# EAGLE schematic keyboard left (EAGLE 6.6.0)
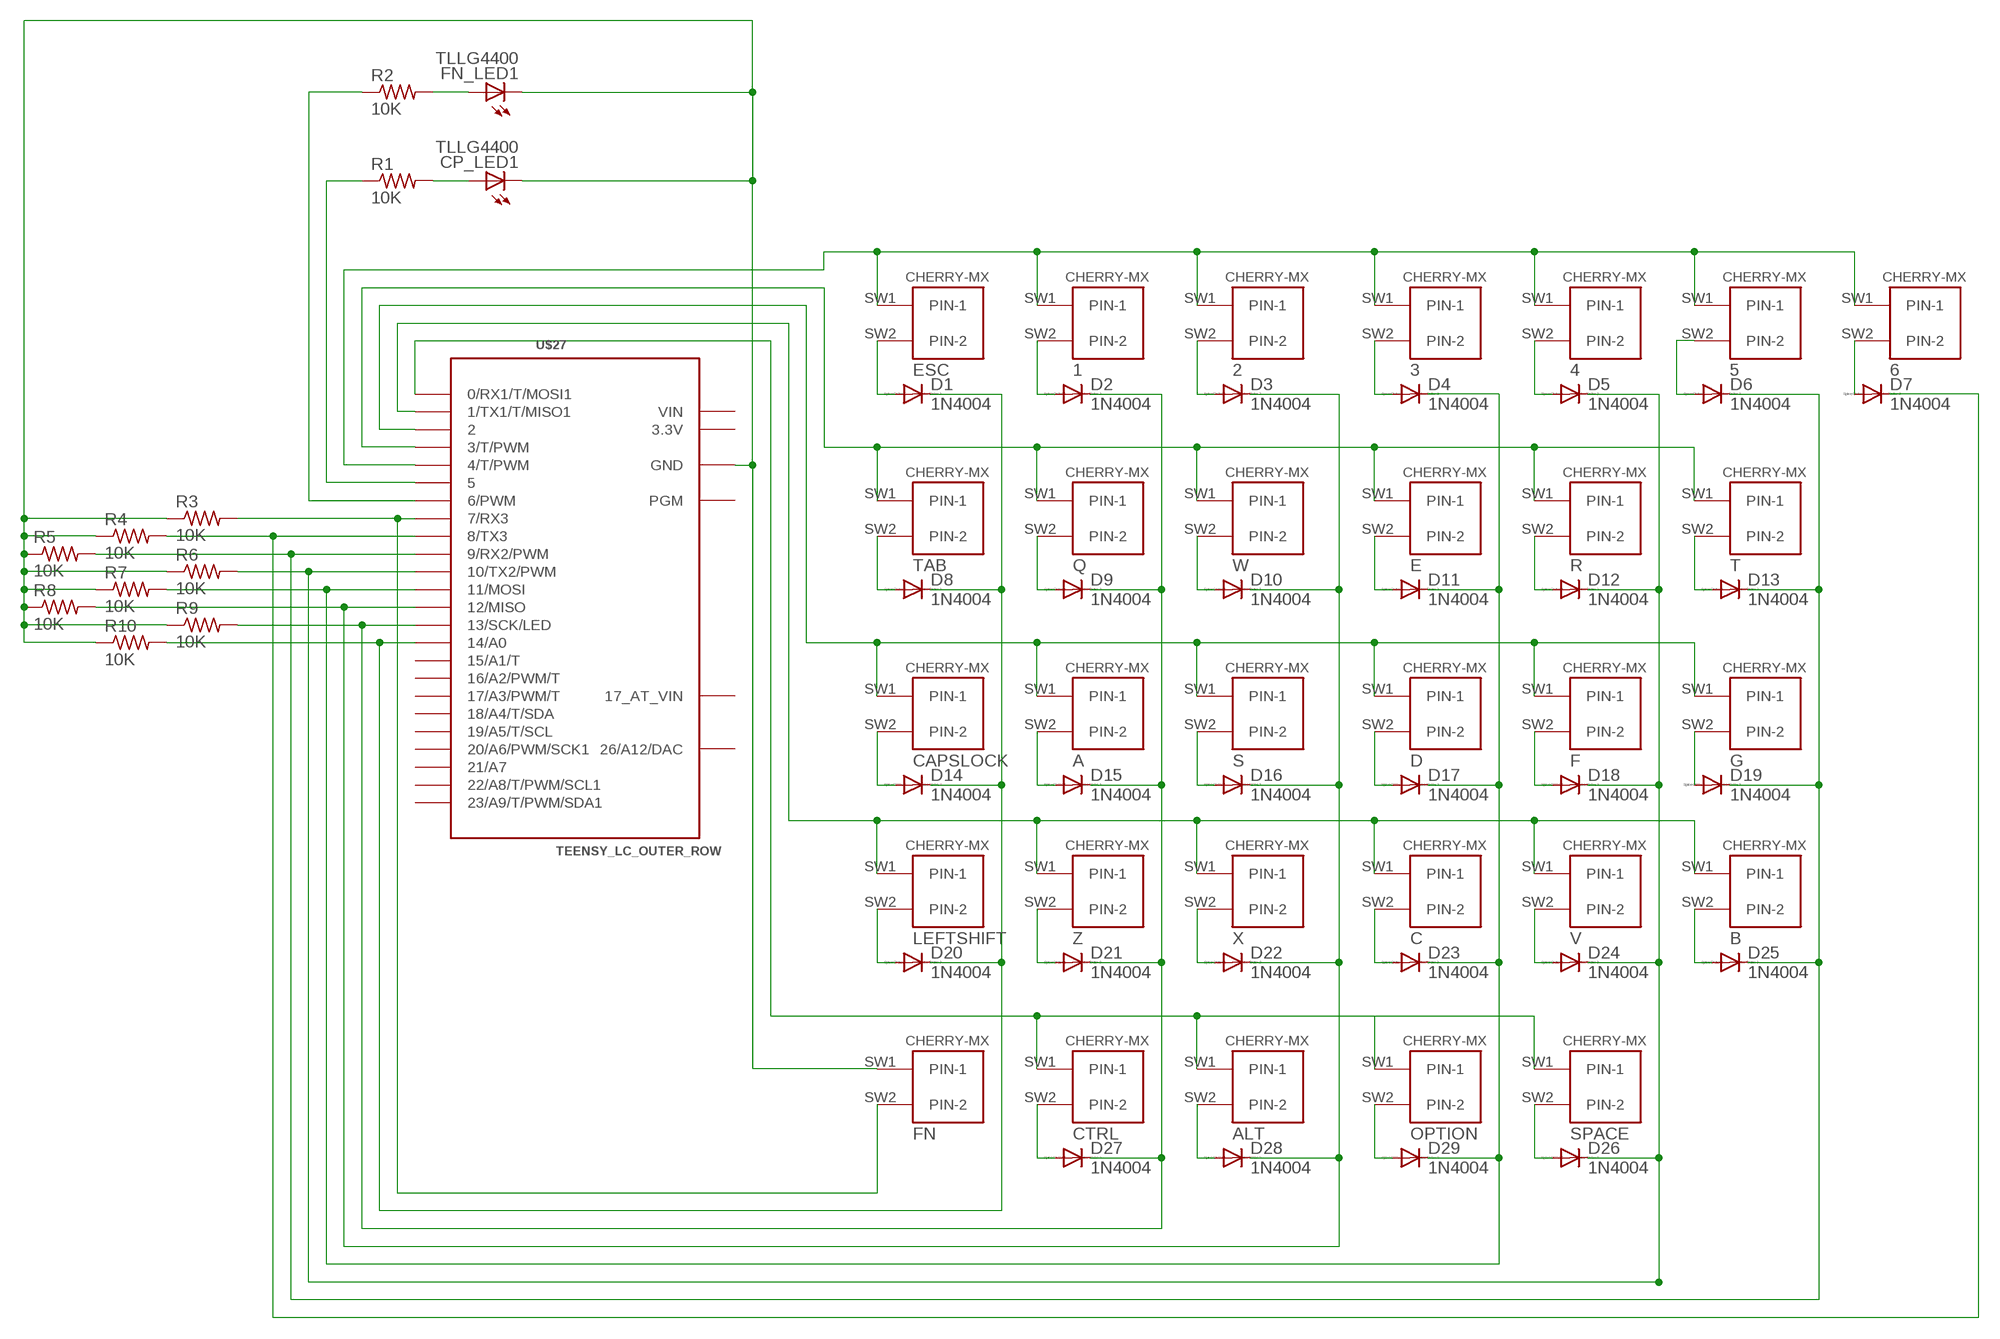
[diagram p0: schematic, sheet 1]

## Parts
1  CHERRY-MX  [CHERRY-MX]
2  CHERRY-MX  [CHERRY-MX]
3  CHERRY-MX  [CHERRY-MX]
4  CHERRY-MX  [CHERRY-MX]
5  CHERRY-MX  [CHERRY-MX]
6  CHERRY-MX  [CHERRY-MX]
A  CHERRY-MX  [CHERRY-MX]
ALT  CHERRY-MX  [CHERRY-MX]
B  CHERRY-MX  [CHERRY-MX]
C  CHERRY-MX  [CHERRY-MX]
CAPSLOCK  CHERRY-MX  [CHERRY-MX]
CP_LED1  TLLG4400  [LED3MM]
CTRL  CHERRY-MX  [CHERRY-MX]
D  CHERRY-MX  [CHERRY-MX]
D1  1N4004  [DO41-10]
D2  1N4004  [DO41-10]
D3  1N4004  [DO41-10]
D4  1N4004  [DO41-10]
D5  1N4004  [DO41-10]
D6  1N4004  [DO41-10]
D7  1N4004  [DO41-10]
D8  1N4004  [DO41-10]
D9  1N4004  [DO41-10]
D10  1N4004  [DO41-10]
D11  1N4004  [DO41-10]
D12  1N4004  [DO41-10]
D13  1N4004  [DO41-10]
D14  1N4004  [DO41-10]
D15  1N4004  [DO41-10]
D16  1N4004  [DO41-10]
D17  1N4004  [DO41-10]
D18  1N4004  [DO41-10]
D19  1N4004  [DO41-10]
D20  1N4004  [DO41-10]
D21  1N4004  [DO41-10]
D22  1N4004  [DO41-10]
D23  1N4004  [DO41-10]
D24  1N4004  [DO41-10]
D25  1N4004  [DO41-10]
D26  1N4004  [DO41-10]
D27  1N4004  [DO41-10]
D28  1N4004  [DO41-10]
D29  1N4004  [DO41-10]
E  CHERRY-MX  [CHERRY-MX]
ESC  CHERRY-MX  [CHERRY-MX]
F  CHERRY-MX  [CHERRY-MX]
FN  CHERRY-MX  [CHERRY-MX]
FN_LED1  TLLG4400  [LED3MM]
G  CHERRY-MX  [CHERRY-MX]
LEFTSHIFT  CHERRY-MX  [CHERRY-MX]
OPTION  CHERRY-MX  [CHERRY-MX]
Q  CHERRY-MX  [CHERRY-MX]
R  CHERRY-MX  [CHERRY-MX]
R1  10K  R-US_0204/7  [0204/7]
R2  10K  R-US_0204/7  [0204/7]
R3  10K  R-US_0204/7  [0204/7]
R4  10K  R-US_0204/7  [0204/7]
R5  10K  R-US_0204/7  [0204/7]
R6  10K  R-US_0204/7  [0204/7]
R7  10K  R-US_0204/7  [0204/7]
R8  10K  R-US_0204/7  [0204/7]
R9  10K  R-US_0204/7  [0204/7]
R10  10K  R-US_0204/7  [0204/7]
S  CHERRY-MX  [CHERRY-MX]
SPACE  CHERRY-MX  [CHERRY-MX]
T  CHERRY-MX  [CHERRY-MX]
TAB  CHERRY-MX  [CHERRY-MX]
U$27  TEENSY_LC_OUTER_ROW  [TEENSY_3.0-3.2&LC_OUTER_ROW]
V  CHERRY-MX  [CHERRY-MX]
W  CHERRY-MX  [CHERRY-MX]
X  CHERRY-MX  [CHERRY-MX]
Z  CHERRY-MX  [CHERRY-MX]

## Nets
N$1: ALT.SW1(PIN-1) CTRL.SW1(PIN-1) OPTION.SW1(PIN-1) U$27.0(0/RX1/T/MOSI1)
N$2: B.SW1(PIN-1) C.SW1(PIN-1) LEFTSHIFT.SW1(PIN-1) U$27.1(1/TX1/T/MISO1) V.SW1(PIN-1) X.SW1(PIN-1) Z.SW1(PIN-1)
N$3: D9.A Q.SW2(PIN-2)
N$4: 1.SW1(PIN-1) 2.SW1(PIN-1) 3.SW1(PIN-1) 4.SW1(PIN-1) 5.SW1(PIN-1) 6.SW1(PIN-1) ESC.SW1(PIN-1) U$27.4(4/T/PWM)
N$5: D1.A ESC.SW2(PIN-2)
N$6: SPACE.SW1(PIN-1)
N$7: D8.A TAB.SW2(PIN-2)
N$8: 1.SW2(PIN-2) D2.A
N$9: 2.SW2(PIN-2) D3.A
N$10: 3.SW2(PIN-2) D4.A
N$11: 4.SW2(PIN-2) D5.A
N$12: 5.SW2(PIN-2) D6.A
N$13: E.SW1(PIN-1) Q.SW1(PIN-1) R.SW1(PIN-1) T.SW1(PIN-1) TAB.SW1(PIN-1) U$27.3(3/T/PWM) W.SW1(PIN-1)
N$14: A.SW1(PIN-1) CAPSLOCK.SW1(PIN-1) D.SW1(PIN-1) F.SW1(PIN-1) G.SW1(PIN-1) S.SW1(PIN-1) U$27.2
N$15: D10.A W.SW2(PIN-2)
N$16: D11.A E.SW2(PIN-2)
N$17: D12.A R.SW2(PIN-2)
N$18: D13.A T.SW2(PIN-2)
N$19: 6.SW2(PIN-2) D7.A
N$20: CAPSLOCK.SW2(PIN-2) D14.A
N$21: FN.SW2(PIN-2) R3.2 U$27.7(7/RX3)
N$22: A.SW2(PIN-2) D15.A
N$23: D20.A LEFTSHIFT.SW2(PIN-2)
N$24: D26.A SPACE.SW2(PIN-2)
N$25: FN_LED1.A R2.2
N$26: D21.A Z.SW2(PIN-2)
N$27: CTRL.SW2(PIN-2) D27.A
N$28: D16.A S.SW2(PIN-2)
N$29: D22.A X.SW2(PIN-2)
N$30: ALT.SW2(PIN-2) D28.A
N$31: D6.C D13.C D19.C D25.C R5.2 U$27.9(9/RX2/PWM)
N$32: D17.A D.SW2(PIN-2)
N$33: C.SW2(PIN-2) D23.A
N$34: D29.A OPTION.SW2(PIN-2)
N$35: CP_LED1.K(C) FN.SW1(PIN-1) FN_LED1.K(C) R3.1 R4.1 R5.1 R6.1 R7.1 R8.1 R9.1 R10.1 U$27.AGND(GND) U$27.GND U$27.GND1(GND)
N$36: D5.C D12.C D18.C D24.C D26.C R6.2 U$27.10(10/TX2/PWM)
N$37: D18.A F.SW2(PIN-2)
N$38: D19.A G.SW2(PIN-2)
N$39: D24.A V.SW2(PIN-2)
N$40: B.SW2(PIN-2) D25.A
N$41: D4.C D11.C D17.C D23.C D29.C R7.2 U$27.11(11/MOSI)
N$42: R1.1 U$27.5
N$43: CP_LED1.A R1.2
N$48: D7.C R4.2 U$27.8(8/TX3)
N$49: D3.C D10.C D16.C D22.C D28.C R8.2 U$27.12(12/MISO)
N$57: R2.1 U$27.6(6/PWM)
N$62: D1.C D8.C D14.C D20.C R10.2 U$27.14/A0
OPTION: D2.C D9.C D15.C D21.C D27.C R9.2 U$27.13(13/SCK/LED)
Unconnected: U$27.15/A1(15/A1/T) U$27.16/A2(16/A2/PWM/T) U$27.17/A3(17/A3/PWM/T) U$27.18/A4(18/A4/T/SDA) U$27.19/A5(19/A5/T/SCL) U$27.20/A6(20/A6/PWM/SCK1) U$27.21/A7 U$27.22/A8(22/A8/T/PWM/SCL1) U$27.23/A9(23/A9/T/PWM/SDA1) U$27.PGM U$27.VBAT(17_AT_VIN)

## Power pins joined to a net without a drawn wire
3.3V: U$27.3.3V U$27.3.3V1(3.3V)
26/A12/DAC: U$27.RESET/DAC(26/A12/DAC)
VIN: U$27.VIN

## Library data of the parts
1-6 A ALT B C CAPSLOCK CTRL D E ESC F FN G LEFTSHIFT OPTION Q R S SPACE T TAB V W X Z = cherrymx:CHERRY-MX: Cherry MX series keyswitch
CP_LED1 FN_LED1 = led:TLLG4400: Low Current (2mA) LED 3 mm Tinted Diffused Package color GREEN Source: Data sheet <http://www.farnell.com/datasheets/391098.pdf>; MF: VISHAY SEMICONDUCTOR; OC_FARNELL: 1612435
D1-D29 = diode:1N4004: DIODE general purpose rectifier, 1 A
R1-R10 = resistor:R-US_: RESISTOR, American symbol
U$27 = Teensy_3_and_LC_Series_Boards_v1.4:TEENSY_LC_OUTER_ROW: Teensy LC with only outer row of pins.